# Altium schematic sheet Calculate input.SchDoc
size A4
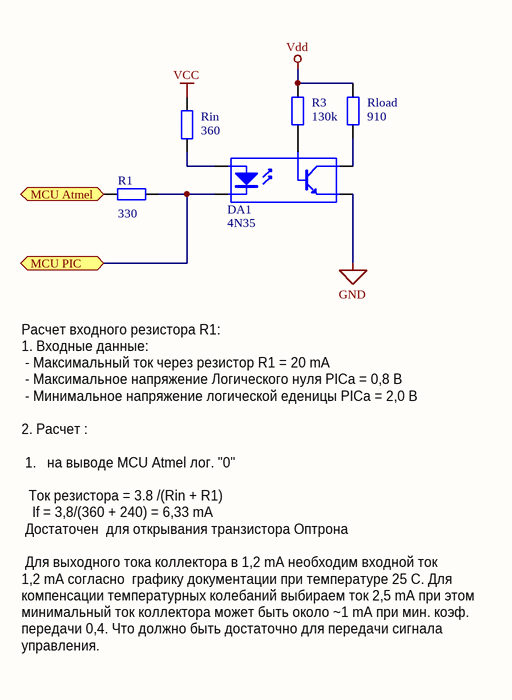
[diagram p0: Calculate input.SchDoc]

## Parts
DA1  4N35  [SOP5(6)]
R1  value 330  [AXIAL-0.4]  (hidden comment: Res2)
R3  value 130k  [AXIAL-0.4]  (hidden comment: Res2)
Rin  value 360  [AXIAL-0.4]  (hidden comment: Res2)
Rload  value 910  [AXIAL-0.4]  (hidden comment: Res2)

## Ports
MCU Atmel, MCU PIC

## Nets
GND: DA1.4(E)
VCC: Rin.2
Vdd: R3.2 Rload.2
MCU Atmel: R1.2 ; port MCU Atmel
MCU PIC: DA1.3(K) R1.1 ; port MCU PIC
NetDA1_1: DA1.1(A) Rin.1
NetDA1_5: DA1.5(C) Rload.1
NetDA1_6: DA1.6(B) R3.1

## Notes on the sheet
- Расчет входного резистора R1:
  1. Входные данные:
  - Максимальный ток через резистор R1 = 20 mA
  - Максимальное напряжение Логического нуля PICa = 0,8 В
  - Минимальное напряжение логической еденицы PICa = 2,0 В
  2. Расчет :
  1.   на выводе MCU Atmel лог. "0"
  Ток резистора = 3.8 /(Rin + R1)
  If = 3,8/(360 + 240) = 6,33 mA
  Достаточен  для открывания транзистора Оптрона
  Для выходного тока коллектора в 1,2 mA необходим входной ток
  1,2 mA согласно  графику документации при температуре 25 С. Для компенсации температурных колебаний выбираем ток 2,5 mA при этом минимальный ток коллектора может быть около ~1 mA при мин. коэф. передачи 0,4. Что должно быть достаточно для передачи сигнала управления.
  Тогда общее сопротивление  оптрона = 3,8/0,0025 = 1520 Ом
  Максимальное сопротивл. R1 = 1520 - 360 = 1160 Ом.
  Минимальное по условию задачи 5 / 0,02 = 250 Ом (номинал 240 Ом.)
  Исходим из того что Напряжение на Резисторе не должно превышать 0,75 В
  Напр. насыщения порта Атмела =  0,5 В (при токе 20 mA)
  (0,75 - 0,3) /0,0025

## Library data of the parts
DA1 = Optoisolator2: 5 Pin Mini Flat Pack Optocoupler; Published: 24-Mar-1999; LatestRevisionDate: 04-Mar-2005; LatestRevisionNote: PCB Footprint replaced, Sch pins re-numbered.; DatasheetVersion: Apr-2004; PackageReference: SOP5(6); Publisher: Altium Limited; PackageDescription: Small Outline; 6 Leads (1 Absent); Body Width 4.4 mm; Pitch 1.27 mm
R1 R3 Rin Rload = Res2: Resistor; Published: 8-Jun-2000; LatestRevisionDate: 17-Jul-2002; LatestRevisionNote: Re-released for DXP Platform.; PackageReference: AXIAL-0.4; Publisher: Altium Limited; PackageDescription: Axial Device, Thru-Hole; 2 Leads; 0.4 in Pin Spacing